# Altium schematic sheet analog-to-digital-stage.SchDoc: ADC Top Level
size A4; DrawnBy: Dylan Vogel; Organization: UTAT SS; DocumentNumber: 2; Revision: 2; SheetNumber: 2; SheetTotal: 13
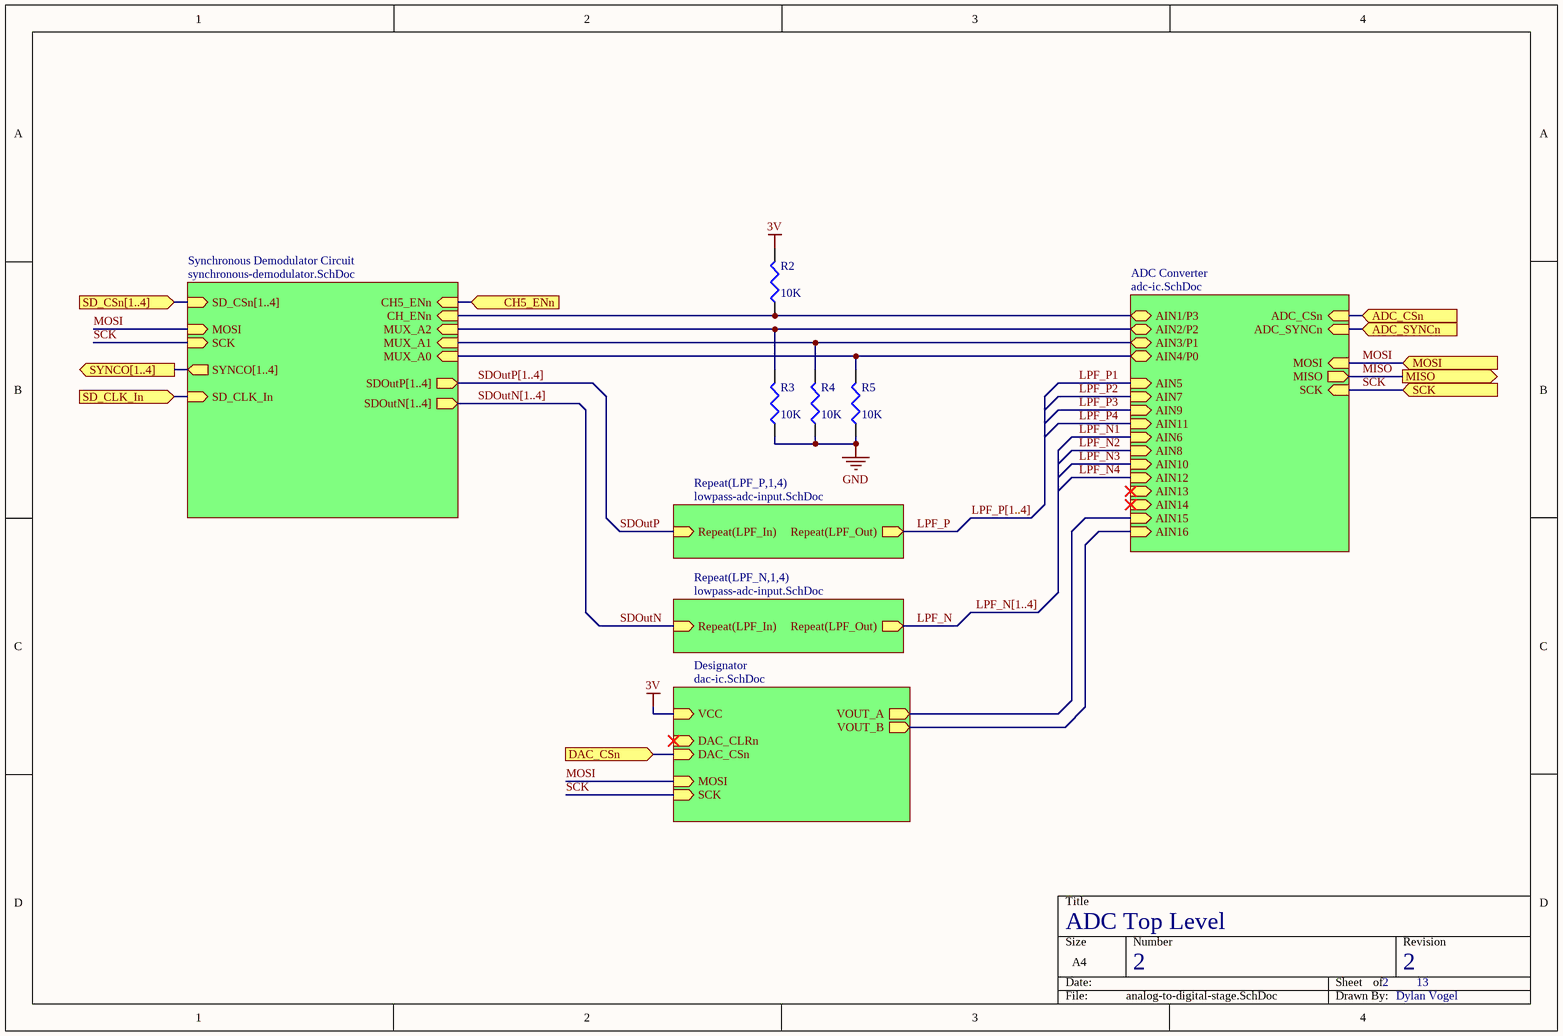
[diagram p0: analog-to-digital-stage.SchDoc]

## Parts
R2  10K  [J1-0603]
R3  10K  [J1-0603]
R4  10K  [J1-0603]
R5  10K  [J1-0603]

## Sub-sheets
ADC Converter = adc-ic.SchDoc: AIN6 (in), MISO (out), AIN3/P1 (bidir), AIN11 (in), ADC_CSn (in), ADC_SYNCn (in), AIN1/P3 (bidir), AIN5 (in), SCK (in), AIN2/P2 (bidir), AIN8 (in), MOSI (in), AIN12 (in), AIN14 (in), AIN9 (in), AIN10 (in), AIN7 (in), AIN16 (in), AIN13 (in), AIN15 (in), AIN4/P0 (bidir)
Designator = dac-ic.SchDoc: VCC (in), DAC_CLRn (in), MOSI (in), SCK (in), DAC_CSn (in), VOUT_B (out), VOUT_A (out)
Repeat(LPF_N,1,4) = lowpass-adc-input.SchDoc: Repeat(LPF_Out) (out), Repeat(LPF_In) (in)
Repeat(LPF_P,1,4) = lowpass-adc-input.SchDoc: Repeat(LPF_Out) (out), Repeat(LPF_In) (in)
Synchronous Demodulator Circuit = synchronous-demodulator.SchDoc: SCK (in), MUX_A0 (in), MUX_A1 (in), CH_ENn (in), MOSI (in), CH5_ENn (in), MUX_A2 (in), SD_CLK_In (in), SD_CSn[1..4] (in), SDOutN[1..4] (out), SDOutP[1..4] (out), SYNCO[1..4] (out)

## Ports
ADC_CSn (in), ADC_SYNCn (in), CH5_ENn (in), DAC_CSn (in), MISO (out), MOSI (in), SCK (in), SD_CLK_In (in), SD_CSn[1..4] (in), SYNCO[1..4] (out)

## Nets
3V: R2.2 ; sheet Designator/VCC
GND: R3.1 R4.1 R5.1
ADC_CSn: port ADC_CSn, sheet ADC Converter/ADC_CSn
ADC_SYNCn: port ADC_SYNCn, sheet ADC Converter/ADC_SYNCn
CH5_ENn: port CH5_ENn, sheet Synchronous Demodulator Circuit/CH5_ENn
DAC_CSn: port DAC_CSn, sheet Designator/DAC_CSn
LPF_N: sheet Repeat(LPF_N,1,4)/Repeat(LPF_Out)
LPF_N1: sheet ADC Converter/AIN6
LPF_N2: sheet ADC Converter/AIN8
LPF_N3: sheet ADC Converter/AIN10
LPF_N4: sheet ADC Converter/AIN12
LPF_P: sheet Repeat(LPF_P,1,4)/Repeat(LPF_Out)
LPF_P1: sheet ADC Converter/AIN5
LPF_P2: sheet ADC Converter/AIN7
LPF_P3: sheet ADC Converter/AIN9
LPF_P4: sheet ADC Converter/AIN11
MISO: port MISO, sheet ADC Converter/MISO
MOSI: port MOSI, sheet ADC Converter/MOSI, sheet Synchronous Demodulator Circuit/MOSI, sheet Designator/MOSI
SCK: port SCK, sheet ADC Converter/SCK, sheet Synchronous Demodulator Circuit/SCK, sheet Designator/SCK
SD_CLK_In: port SD_CLK_In, sheet Synchronous Demodulator Circuit/SD_CLK_In
SDOutN: sheet Repeat(LPF_N,1,4)/Repeat(LPF_In)
SDOutP: sheet Repeat(LPF_P,1,4)/Repeat(LPF_In)
NetR2_1: R2.1 ; sheet ADC Converter/AIN1/P3, sheet Synchronous Demodulator Circuit/CH_ENn
NetR3_2: R3.2 ; sheet ADC Converter/AIN2/P2, sheet Synchronous Demodulator Circuit/MUX_A2
NetR4_2: R4.2 ; sheet ADC Converter/AIN3/P1, sheet Synchronous Demodulator Circuit/MUX_A1
NetR5_2: R5.2 ; sheet ADC Converter/AIN4/P0, sheet Synchronous Demodulator Circuit/MUX_A0
(unnamed): sheet ADC Converter/AIN16, sheet Designator/VOUT_B
(unnamed): sheet ADC Converter/AIN15, sheet Designator/VOUT_A

## Buses and harness runs
bus LPF_N[1..4]
bus LPF_P[1..4]
bus port SD_CSn[1..4] = sheet Synchronous Demodulator Circuit/SD_CSn[1..4]
bus port SYNCO[1..4] = sheet Synchronous Demodulator Circuit/SYNCO[1..4]
bus SDOutN[1..4] = sheet Synchronous Demodulator Circuit/SDOutN[1..4]
bus SDOutP[1..4] = sheet Synchronous Demodulator Circuit/SDOutP[1..4]

## Library data of the parts
R2 = Res3: 10K pull-up for MUX ENn pin; Published: 8-Jun-2000; LatestRevisionDate: 29-May-2009; LatestRevisionNote: IPC-7351 Footprint Added.; PackageReference: J1-0603; Publisher: Altium Limited; PackageDescription: Chip Resistor; Value: 10K
R3-R5 = Res3: 10K pulldown on MUX channel selection; Published: 8-Jun-2000; LatestRevisionDate: 29-May-2009; LatestRevisionNote: IPC-7351 Footprint Added.; PackageReference: J1-0603; Publisher: Altium Limited; PackageDescription: Chip Resistor; Value: 10K